# EAGLE schematic MCP3208Pi (EAGLE 7.3.0)
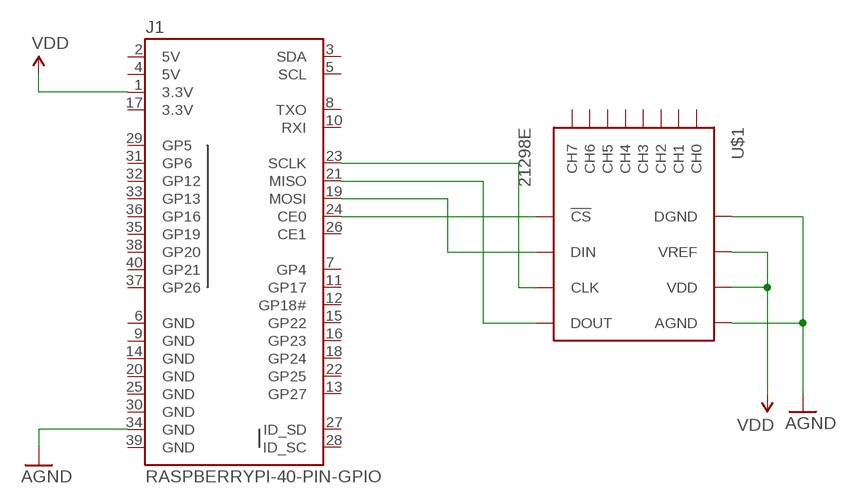
[diagram p0: schematic, sheet 1]

## Parts
J1  RASPBERRYPI-40-PIN-GPIO  [2X20-SHROUDED]
U$1  21298E  [PDIP16]

## Nets
AGND: U$1.P$9(DGND) U$1.P$14(AGND)
N$1: J1.24(CE0) U$1.P$10(!CS)
N$2: J1.19(MOSI) U$1.P$11(DIN)
N$3: J1.21(MISO) U$1.P$12(DOUT)
N$4: J1.23(SCLK) U$1.P$13(CLK)
VDD: U$1.P$15(VREF) U$1.P$16(VDD)
Unconnected: J1.3(SDA) J1.5(SCL) J1.7(GP4) J1.8(TXO) J1.10(RXI) J1.11(GP17) J1.12(GP18#) J1.13(GP27) J1.15(GP22) J1.16(GP23) J1.18(GP24) J1.22(GP25) J1.26(CE1) J1.27(ID_SD) J1.28(ID_SC) J1.29(GP5) J1.31(GP6) J1.32(GP12) J1.33(GP13) J1.35(GP19) J1.36(GP16) J1.37(GP26) J1.38(GP20) J1.40(GP21) U$1.P$1(CH0) U$1.P$2(CH1) U$1.P$3(CH2) U$1.P$4(CH3) U$1.P$5(CH4) U$1.P$6(CH5) U$1.P$7(CH6) U$1.P$8(CH7)

## Power pins joined to a net without a drawn wire
3.3V: J1.1(3.3V) J1.17(3.3V)
5V: J1.2(5V) J1.4(5V)
GND: J1.6(GND) J1.9(GND) J1.14(GND) J1.20(GND) J1.25(GND) J1.30(GND) J1.34(GND) J1.39(GND)

## Library data of the parts
J1 = SparkFun-Boards:RASPBERRYPI-40-PIN-GPIO: Second Generation Raspberry Pi GPIO Header 2x20 pin connector, as found on B, B+, A+ models.
U$1 = MCP3208:21298E